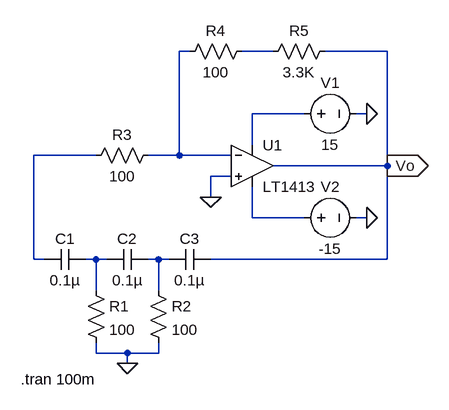
[diagram p0: schematic Run_2.asc]
Run_2.asc, the LTspice schematic file:
Version 4
SHEET 1 880 680
WIRE 384 96 368 96
WIRE 512 96 464 96
WIRE 688 96 592 96
WIRE 560 192 480 192
WIRE 656 192 640 192
WIRE 480 240 480 192
WIRE 240 256 144 256
WIRE 368 256 368 96
WIRE 368 256 320 256
WIRE 448 256 368 256
WIRE 688 272 688 96
WIRE 688 272 512 272
WIRE 448 288 416 288
WIRE 416 320 416 288
WIRE 480 352 480 304
WIRE 560 352 480 352
WIRE 656 352 640 352
WIRE 144 416 144 256
WIRE 160 416 144 416
WIRE 240 416 224 416
WIRE 256 416 240 416
WIRE 336 416 320 416
WIRE 352 416 336 416
WIRE 688 416 688 272
WIRE 688 416 416 416
WIRE 240 464 240 416
WIRE 336 464 336 416
WIRE 240 560 240 544
WIRE 288 560 240 560
WIRE 336 560 336 544
WIRE 336 560 288 560
WIRE 288 576 288 560
FLAG 656 352 0
FLAG 656 192 0
FLAG 416 320 0
FLAG 288 576 0
FLAG 688 272 Vo
IOPIN 688 272 Out
SYMBOL cap 224 400 R90
WINDOW 0 0 32 VBottom 2
WINDOW 3 32 32 VTop 2
SYMATTR InstName C1
SYMATTR Value 0.1µ
SYMBOL cap 320 400 R90
WINDOW 0 0 32 VBottom 2
WINDOW 3 32 32 VTop 2
SYMATTR InstName C2
SYMATTR Value 0.1µ
SYMBOL cap 416 400 R90
WINDOW 0 0 32 VBottom 2
WINDOW 3 32 32 VTop 2
SYMATTR InstName C3
SYMATTR Value 0.1µ
SYMBOL OpAmps\\LT1413 480 208 R0
SYMATTR InstName U1
SYMBOL voltage 544 192 R270
WINDOW 0 32 56 VTop 2
WINDOW 3 -32 56 VBottom 2
WINDOW 123 0 0 Left 0
WINDOW 39 0 0 Left 0
SYMATTR InstName V1
SYMATTR Value 15
SYMBOL voltage 544 352 R270
WINDOW 0 32 56 VTop 2
WINDOW 3 -32 56 VBottom 2
WINDOW 123 0 0 Left 0
WINDOW 39 0 0 Left 0
SYMATTR InstName V2
SYMATTR Value -15
SYMBOL res 224 448 R0
SYMATTR InstName R1
SYMATTR Value 100
SYMBOL res 320 448 R0
SYMATTR InstName R2
SYMATTR Value 100
SYMBOL res 336 240 R90
WINDOW 0 0 56 VBottom 2
WINDOW 3 32 56 VTop 2
SYMATTR InstName R3
SYMATTR Value 100
SYMBOL res 480 80 R90
WINDOW 0 0 56 VBottom 2
WINDOW 3 32 56 VTop 2
SYMATTR InstName R4
SYMATTR Value 100
SYMBOL res 608 80 R90
WINDOW 0 0 56 VBottom 2
WINDOW 3 32 56 VTop 2
SYMATTR InstName R5
SYMATTR Value 3.3K
TEXT 124 600 Left 2 !.tran 100m

The netlist it stands for:
* Run_2.asc
C1 N006 N004 0.1µ
C2 N007 N006 0.1µ
C3 Vo N007 0.1µ
XU1 0 N001 N003 N005 Vo LT1413  ; pins In+ In- V+ V- OUT
V1 N003 0 15
V2 N005 0 -15
R1 N006 0 100
R2 N007 0 100
R3 N001 N004 100
R4 N002 N001 100
R5 Vo N002 3.3K
.tran 100m
.lib LTC.lib
.backanno
.end